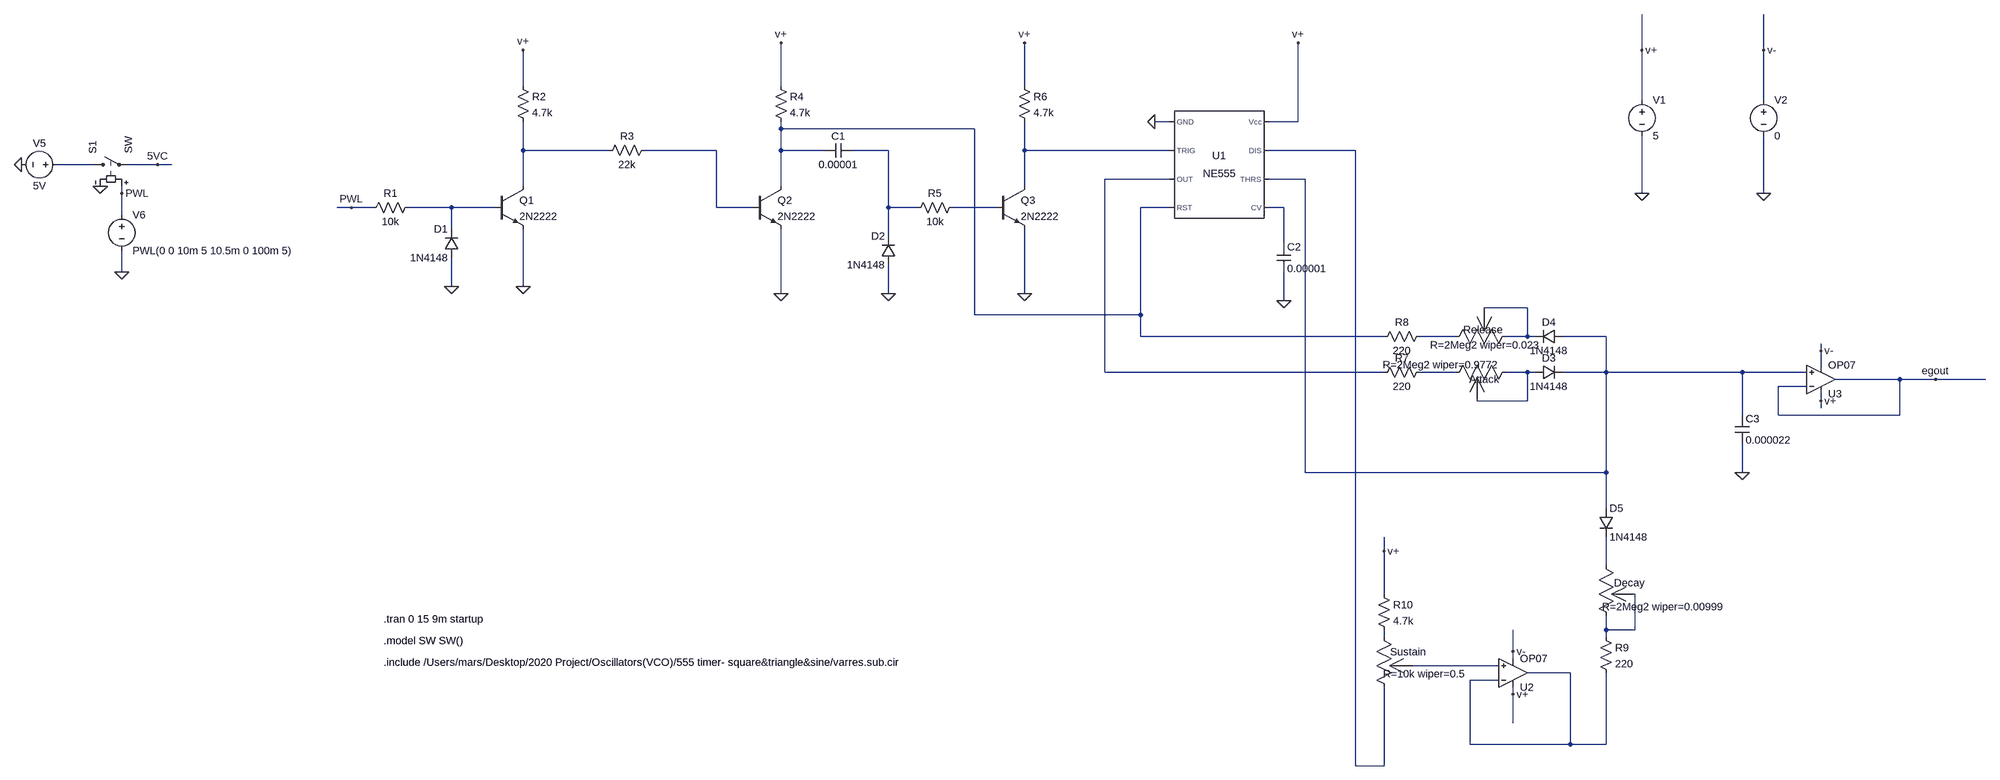
[diagram p0: schematic Envelope Generator (EG).asc]
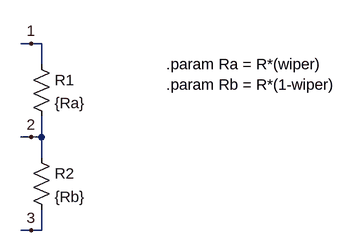
[diagram p1: sub-circuit varres.asc]
Envelope Generator (EG).asc, the LTspice schematic file:
Version 4
SHEET 1 8084 3076
WIRE 1856 -496 1856 -576
WIRE 2128 -496 2128 -576
WIRE -688 -416 -688 -496
WIRE -112 -416 -112 -512
WIRE 432 -416 432 -512
WIRE 1856 -384 1856 -496
WIRE 2128 -384 2128 -496
WIRE 800 -336 768 -336
WIRE 1088 -336 1088 -512
WIRE 1088 -336 1024 -336
WIRE -112 -320 -112 -336
WIRE 320 -320 -112 -320
WIRE -688 -272 -688 -336
WIRE -496 -272 -688 -272
WIRE -256 -272 -416 -272
WIRE -112 -272 -112 -320
WIRE -16 -272 -112 -272
WIRE 128 -272 48 -272
WIRE 432 -272 432 -336
WIRE 800 -272 432 -272
WIRE 1216 -272 1024 -272
WIRE -1792 -240 -1872 -240
WIRE -1648 -240 -1712 -240
WIRE -1616 -240 -1648 -240
WIRE 800 -208 656 -208
WIRE 1104 -208 1024 -208
WIRE -688 -192 -688 -272
WIRE -112 -192 -112 -272
WIRE 432 -192 432 -272
WIRE -1728 -176 -1728 -192
WIRE 1856 -176 1856 -304
WIRE 2128 -176 2128 -304
WIRE -1072 -144 -1104 -144
WIRE -1024 -144 -1072 -144
WIRE -848 -144 -944 -144
WIRE -752 -144 -848 -144
WIRE -256 -144 -256 -272
WIRE -176 -144 -256 -144
WIRE 128 -144 128 -272
WIRE 192 -144 128 -144
WIRE 368 -144 272 -144
WIRE 800 -144 736 -144
WIRE 1056 -144 1024 -144
WIRE -1728 -128 -1728 -176
WIRE -848 -96 -848 -144
WIRE 128 -80 128 -144
WIRE 1056 -64 1056 -144
WIRE -1728 0 -1728 -48
WIRE -848 32 -848 -32
WIRE -688 32 -688 -96
WIRE -112 48 -112 -96
WIRE 128 48 128 -16
WIRE 432 48 432 -96
WIRE 1056 64 1056 0
WIRE 1600 80 1504 80
WIRE 320 96 320 -320
WIRE 736 96 736 -144
WIRE 736 96 320 96
WIRE 736 144 736 96
WIRE 1280 144 736 144
WIRE 1440 144 1360 144
WIRE 1600 144 1600 80
WIRE 1600 144 1552 144
WIRE 1616 144 1600 144
WIRE 1776 144 1680 144
WIRE 2256 176 2256 160
WIRE 2256 208 2256 176
WIRE 656 224 656 -208
WIRE 1280 224 656 224
WIRE 1440 224 1360 224
WIRE 1600 224 1552 224
WIRE 1616 224 1600 224
WIRE 1776 224 1776 144
WIRE 1776 224 1680 224
WIRE 2080 224 1776 224
WIRE 2224 224 2080 224
WIRE 2432 240 2288 240
WIRE 2512 240 2432 240
WIRE 2624 240 2512 240
WIRE 2224 256 2160 256
WIRE 1600 288 1600 224
WIRE 1600 288 1488 288
WIRE 2256 288 2256 272
WIRE 2256 304 2256 288
WIRE 2080 320 2080 224
WIRE 2160 320 2160 256
WIRE 2432 320 2432 240
WIRE 2432 320 2160 320
WIRE 1104 448 1104 -208
WIRE 1776 448 1776 224
WIRE 1776 448 1104 448
WIRE 2080 448 2080 384
WIRE 1776 528 1776 448
WIRE 1280 624 1280 592
WIRE 1776 656 1776 592
WIRE 1280 720 1280 624
WIRE 1776 800 1776 768
WIRE 1840 800 1840 720
WIRE 1840 800 1776 800
WIRE 1280 816 1280 800
WIRE 1776 816 1776 800
WIRE 1568 848 1568 800
WIRE 1568 864 1568 848
WIRE 1536 880 1344 880
WIRE 1696 896 1600 896
WIRE 1536 912 1472 912
WIRE 1568 944 1568 928
WIRE 1568 1008 1568 944
WIRE 1472 1056 1472 912
WIRE 1696 1056 1696 896
WIRE 1696 1056 1472 1056
WIRE 1776 1056 1776 896
WIRE 1776 1056 1696 1056
WIRE 1216 1104 1216 -272
WIRE 1280 1104 1280 928
WIRE 1280 1104 1216 1104
FLAG -848 32 0
FLAG -688 32 0
FLAG -112 48 0
FLAG 128 48 0
FLAG 432 48 0
FLAG 768 -336 0
FLAG 1056 64 0
FLAG 2080 448 0
FLAG 2512 240 egout
FLAG 1856 -176 0
FLAG 1856 -496 v+
FLAG -688 -496 v+
FLAG -112 -512 v+
FLAG 432 -512 v+
FLAG 1088 -512 v+
FLAG 1280 624 v+
FLAG 2256 288 v+
FLAG 1568 944 v+
FLAG 2256 176 v-
FLAG 1568 848 v-
FLAG 2128 -176 0
FLAG 2128 -496 v-
FLAG -1072 -144 PWL
FLAG -1776 -192 0
FLAG -1728 0 0
FLAG -1648 -240 5VC
FLAG -1952 -240 0
FLAG -1728 -176 PWL
SYMBOL res -928 -160 R90
WINDOW 0 0 56 VBottom 2
WINDOW 3 32 56 VTop 2
SYMATTR InstName R1
SYMATTR Value 10k
SYMBOL diode -832 -32 R180
WINDOW 0 24 64 Left 2
WINDOW 3 24 0 Left 2
SYMATTR InstName D1
SYMATTR Value 1N4148
SYMBOL npn -752 -192 R0
SYMATTR InstName Q1
SYMATTR Value 2N2222
SYMBOL res -704 -432 R0
SYMATTR InstName R2
SYMATTR Value 4.7k
SYMBOL res -400 -288 R90
WINDOW 0 0 56 VBottom 2
WINDOW 3 32 56 VTop 2
SYMATTR InstName R3
SYMATTR Value 22k
SYMBOL npn -176 -192 R0
SYMATTR InstName Q2
SYMATTR Value 2N2222
SYMBOL res -128 -432 R0
SYMATTR InstName R4
SYMATTR Value 4.7k
SYMBOL cap 48 -288 R90
WINDOW 0 0 32 VBottom 2
WINDOW 3 32 32 VTop 2
SYMATTR InstName C1
SYMATTR Value 0.00001
SYMBOL diode 144 -16 R180
WINDOW 0 24 64 Left 2
WINDOW 3 24 0 Left 2
SYMATTR InstName D2
SYMATTR Value 1N4148
SYMBOL res 288 -160 R90
WINDOW 0 0 56 VBottom 2
WINDOW 3 32 56 VTop 2
SYMATTR InstName R5
SYMATTR Value 10k
SYMBOL npn 368 -192 R0
SYMATTR InstName Q3
SYMATTR Value 2N2222
SYMBOL res 416 -432 R0
SYMATTR InstName R6
SYMATTR Value 4.7k
SYMBOL NE555 912 -240 R0
SYMATTR InstName U1
SYMBOL res 1376 208 R90
WINDOW 0 0 56 VBottom 2
WINDOW 3 32 56 VTop 2
SYMATTR InstName R7
SYMATTR Value 220
SYMBOL diode 1616 240 R270
WINDOW 0 32 32 VTop 2
WINDOW 3 0 32 VBottom 2
SYMATTR InstName D3
SYMATTR Value 1N4148
SYMBOL res 1376 128 R90
WINDOW 0 0 56 VBottom 2
WINDOW 3 32 56 VTop 2
SYMATTR InstName R8
SYMATTR Value 220
SYMBOL diode 1680 128 R90
WINDOW 0 0 32 VBottom 2
WINDOW 3 32 32 VTop 2
SYMATTR InstName D4
SYMATTR Value 1N4148
SYMBOL diode 1760 528 R0
SYMATTR InstName D5
SYMATTR Value 1N4148
SYMBOL res 1760 800 R0
SYMATTR InstName R9
SYMATTR Value 220
SYMBOL OP07 1568 960 M180
SYMATTR InstName U2
SYMBOL res 1264 704 R0
SYMATTR InstName R10
SYMATTR Value 4.7k
SYMBOL cap 1040 -64 R0
SYMATTR InstName C2
SYMATTR Value 0.00001
SYMBOL OP07 2256 304 M180
SYMATTR InstName U3
SYMBOL cap 2064 320 R0
SYMATTR InstName C3
SYMATTR Value 0.000022
SYMBOL voltage 1856 -400 R0
WINDOW 123 0 0 Left 0
WINDOW 39 0 0 Left 0
SYMATTR InstName V1
SYMATTR Value 5
SYMBOL voltage 2128 -400 R0
WINDOW 123 0 0 Left 0
WINDOW 39 0 0 Left 0
SYMATTR InstName V2
SYMATTR Value 0
SYMBOL varres 1264 832 R0
WINDOW 0 30 17 Left 2
WINDOW 3 14 66 Left 2
SYMATTR InstName Sustain
SYMBOL varres 1456 160 R270
WINDOW 0 31 1 VRight 2
WINDOW 3 -3 -73 VRight 2
SYMATTR InstName Release
SYMATTR Value R=2Meg2 wiper=0.023
SYMBOL varres 1536 208 R90
WINDOW 0 32 -1 VRight 2
WINDOW 3 -1 0 VRight 2
SYMATTR InstName Attack
SYMATTR Value R=2Meg2 wiper=0.9772
SYMBOL varres 1760 672 R0
WINDOW 0 34 23 Left 2
WINDOW 3 7 76 Left 2
SYMATTR InstName Decay
SYMATTR Value R=2Meg2 wiper=0.00999
SYMBOL voltage -1856 -240 R90
WINDOW 0 -32 56 VBottom 2
WINDOW 3 32 56 VTop 2
SYMATTR InstName V5
SYMATTR Value 5V
SYMBOL sw -1808 -240 R270
SYMATTR InstName S1
SYMBOL voltage -1728 -144 R0
SYMATTR InstName V6
SYMATTR Value PWL(0 0 10m 5 10.5m 0 100m 5)
TEXT -1000 824 Left 2 !.model SW SW()
TEXT -1000 776 Left 2 !.tran 0 15 9m startup
TEXT -1000 872 Left 2 !.include /Users/mars/Desktop/2020 Project/Oscillators(VCO)/555 timer- square&triangle&sine/varres.sub.cir

varres.asc, the sub-circuit schematic file:
Version 4
SHEET 1 892 680
WIRE 368 144 352 144
WIRE 384 144 368 144
WIRE 384 176 384 144
WIRE 368 288 352 288
WIRE 384 288 384 256
WIRE 384 288 368 288
WIRE 384 320 384 288
WIRE 368 432 352 432
WIRE 384 432 384 400
WIRE 384 432 368 432
FLAG 368 144 1
FLAG 368 288 2
FLAG 368 432 3
SYMBOL res 368 160 R0
SYMATTR InstName R1
SYMATTR Value {Ra}
SYMBOL res 368 304 R0
SYMATTR InstName R2
SYMATTR Value {Rb}
TEXT 576 176 Left 2 !.param Ra = R*(wiper)\n.param Rb = R*(1-wiper)

The netlist it stands for:
* Envelope Generator (EG).asc
R1 N010 PWL 10k
D1 0 N010 1N4148
Q1 N002 N010 0 0 2N2222
R2 v+ N002 4.7k
R3 N003 N002 22k
Q2 N001 N003 0 0 2N2222
R4 v+ N001 4.7k
C1 N004 N001 0.00001
D2 0 N004 1N4148
R5 N011 N004 10k
Q3 N005 N011 0 0 2N2222
R6 v+ N005 4.7k
XU1 0 N005 N008 N001 N012 N009 N006 v+ NE555  ; pins GND TRIG OUT RST CV THRS DIS Vcc
R7 N015 N008 220
D3 N016 N009 1N4148
R8 N014 N001 220
D4 N009 N013 1N4148
D5 N009 N017 1N4148
R9 N018 N021 220
XU2 N020 N021 v+ v- N021 LT1001  ; OP07, pins In+ In- V+ V- OUT
R10 v+ N019 4.7k
C2 N012 0 0.00001
XU3 N009 egout v+ v- egout LT1001  ; OP07, pins In+ In- V+ V- OUT
C3 N009 0 0.000022
V1 v+ 0 5
V2 v- 0 0
XSustain N006 N020 N019 varres params: R=10k wiper=0.5
XRelease N013 N013 N014 varres params: R=2Meg2 wiper=0.023
XAttack N015 N016 N016 varres params: R=2Meg2 wiper=0.9772
XDecay N018 N018 N017 varres params: R=2Meg2 wiper=0.00999
V5 N007 0 5V
S1 N007 5VC PWL 0 SW
V6 PWL 0 PWL(0 0 10m 5 10.5m 0 100m 5)

* block symbol definitions
.subckt varres 3 2 1
R1 1 2 {Ra}
R2 2 3 {Rb}
.param Ra = R*(wiper)
.param Rb = R*(1-wiper)
.ends varres

.model D D
.lib standard.dio
.model NPN NPN
.model PNP PNP
.lib standard.bjt
.model SW SW()
.tran 0 15 9m startup
.include /Users/mars/Desktop/2020 Project/Oscillators(VCO)/555 timer- square&triangle&sine/varres.sub.cir
.lib NE555.sub
.lib LTC.lib
.backanno
.end